# EAGLE design ninja (EAGLE 5.05)
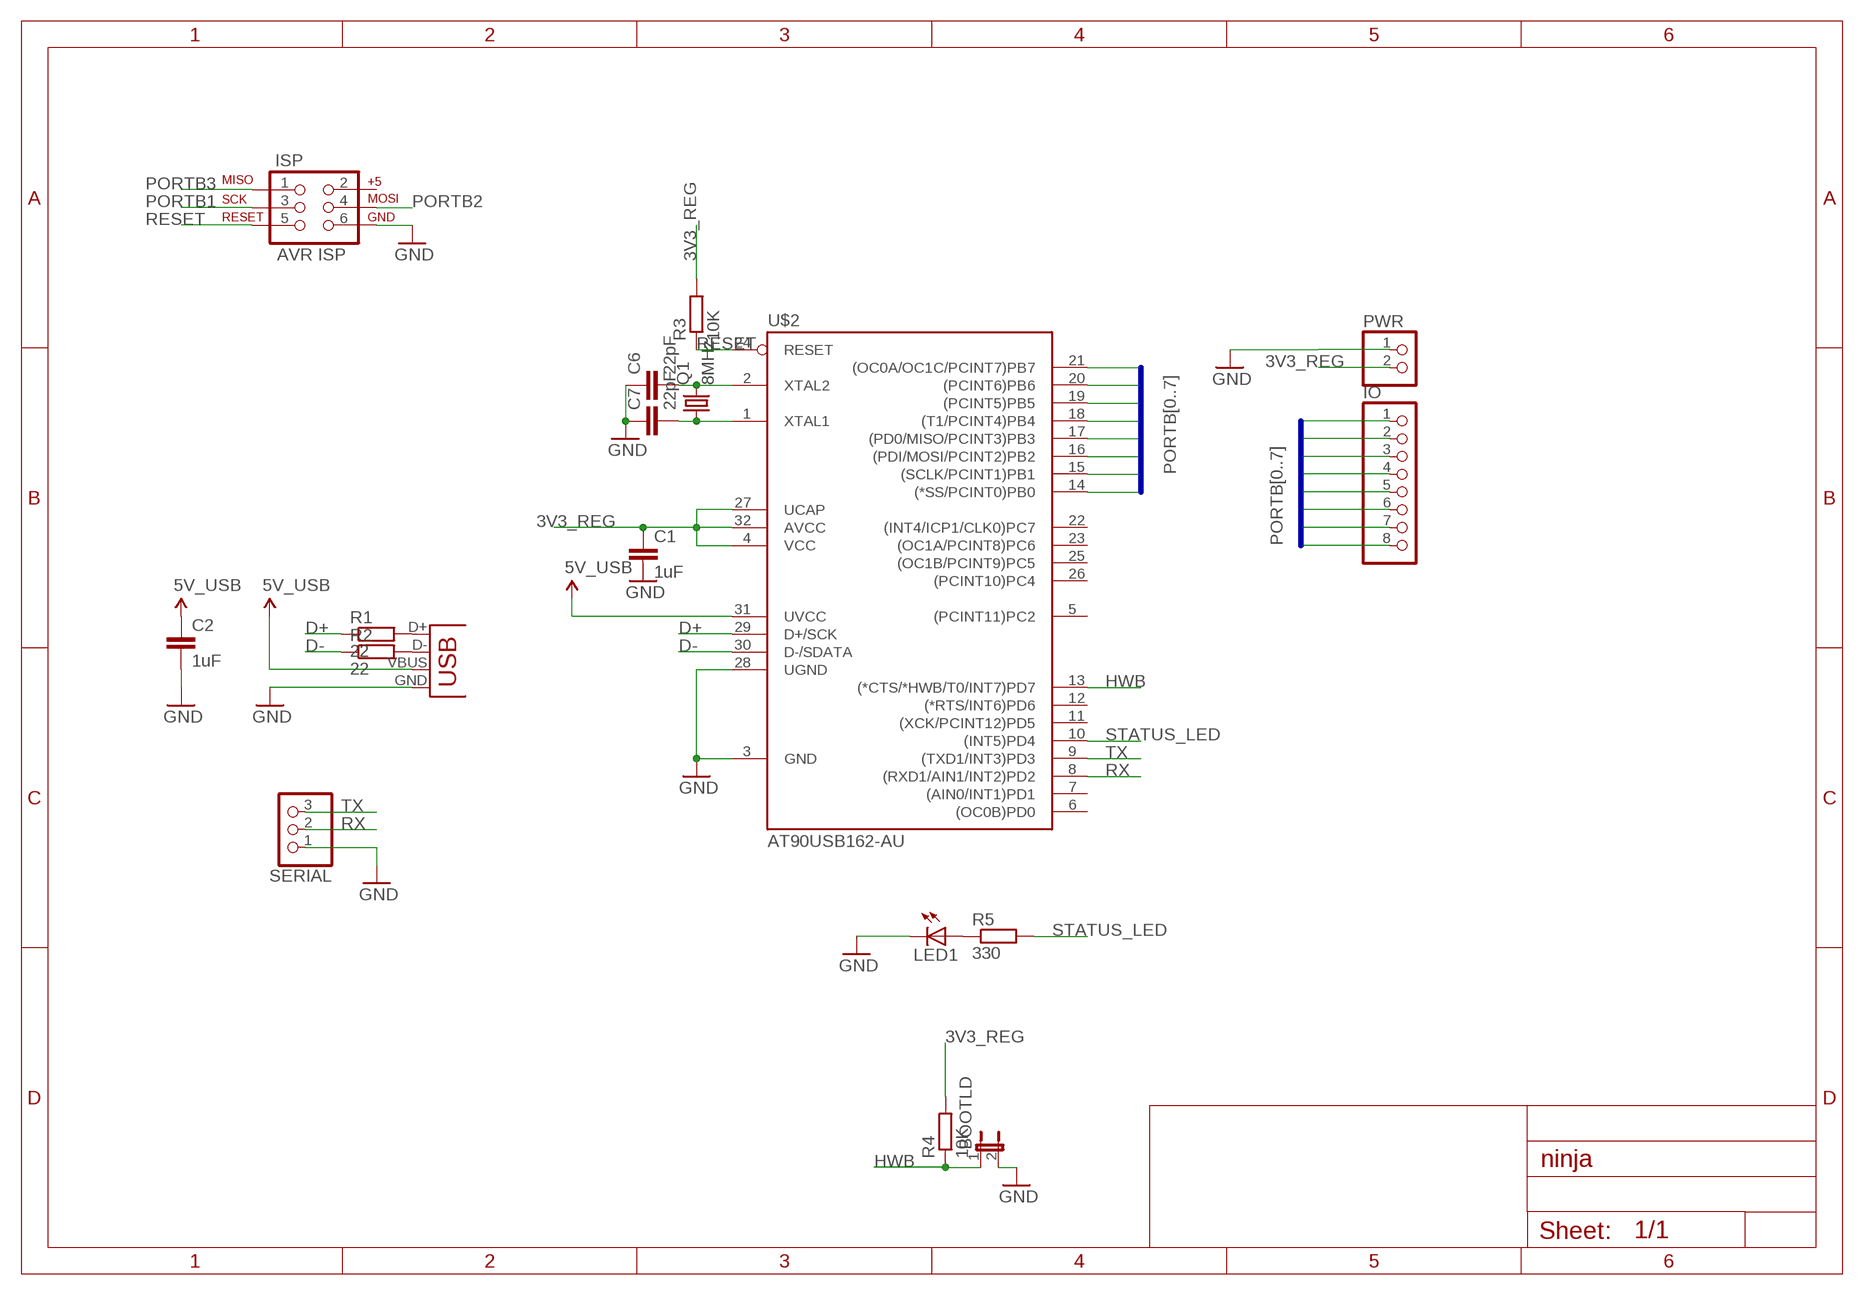
[diagram p0: schematic, sheet 1]

## Parts
BOOTLD  JUMPER-2PTH  [1X02]
C1  1uF  C-EUC1206  [C1206]
C2  1uF  C-EUC1206  [C1206]
C6  22pF  C-EUC1206  [C1206]
C7  22pF  C-EUC1206  [C1206]
IO  PINHD-1X8  [1X08]
ISP  AVR ISP  AVR_SPI_PRG_6NS  [2X3-NS]
LED1  LED1206  [LED-1206]
PWR  PINHD-1X2  [1X02]
Q1  8MHz  CRYSTALHC49U-V  [HC49U-V]
R1  22  R-EU_M1206  [M1206]
R2  22  R-EU_M1206  [M1206]
R3  10K  R-EU_M1206  [M1206]
R4  10K  R-EU_M1206  [M1206]
R5  330  R-EU_M1206  [M1206]
SERIAL  PINHD-1X3  [1X03]
U$2  AT90USB162-AU  [TQFP32-08]
X1  USBSMD  [USB-MINIB]

## Nets
3V3_REG: C1.1 PWR.2 R3.2 R4.2 U$2.4(VCC) U$2.27(UCAP) U$2.32(AVCC)
5V: C2.1 U$2.31(UVCC) X1.VBUS ; supply symbol labelled 5V_USB
D+: R1.1 U$2.29(D+/SCK)
D-: R2.1 U$2.30(D-/SDATA)
GND: BOOTLD.2 C1.2 C2.2 C6.1 C7.1 ISP.6 LED1.C PWR.1 SERIAL.1 U$2.3(GND) U$2.28(UGND) X1.GND
HWB: BOOTLD.1 R4.1 U$2.13((*CTS/*HWB/T0/INT7)PD7)
N$1: R1.2 X1.D+
N$2: R2.2 X1.D-
N$3: C6.2 Q1.2 U$2.2(XTAL2)
N$4: C7.2 Q1.1 U$2.1(XTAL1)
N$6: LED1.A R5.1
PORTB0: IO.8 U$2.14((*SS/PCINT0)PB0)
PORTB1: IO.7 ISP.3 U$2.15((SCLK/PCINT1)PB1)
PORTB2: IO.6 ISP.4 U$2.16((PDI/MOSI/PCINT2)PB2)
PORTB3: IO.5 ISP.1 U$2.17((PD0/MISO/PCINT3)PB3)
PORTB4: IO.4 U$2.18((T1/PCINT4)PB4)
PORTB5: IO.3 U$2.19((PCINT5)PB5)
PORTB6: IO.2 U$2.20((PCINT6)PB6)
PORTB7: IO.1 U$2.21((OC0A/OC1C/PCINT7)PB7)
RESET: ISP.5 R3.1 U$2.24(RESET)
RX: SERIAL.2 U$2.8((RXD1/AIN1/INT2)PD2)
STATUS_LED: R5.2 U$2.10((INT5)PD4)
TX: SERIAL.3 U$2.9((TXD1/INT3)PD3)
Unconnected: ISP.2 U$2.5((PCINT11)PC2) U$2.6((OC0B)PD0) U$2.7((AIN0/INT1)PD1) U$2.11((XCK/PCINT12)PD5) U$2.12((*RTS/INT6)PD6) U$2.22((INT4/ICP1/CLK0)PC7) U$2.23((OC1A/PCINT8)PC6) U$2.25((OC1B/PCINT9)PC5) U$2.26((PCINT10)PC4)

## Buses
PORTB[0..7]

## Library data of the parts
BOOTLD = SparkFun:JUMPER-2: Jumper Basic 0.1" spaced jumper. Use with breakaway headers.
C1 C2 C6 C7 = rcl:C-EU: CAPACITOR, European symbol
IO = pinhead:PINHD-1X8: PIN HEADER
ISP = SparkFun:AVR_SPI_PRG_6: AVR ISP 6 Pin This is the reduced ISP connector for AVR programming. Common on Arduino. This footprint will take up less PCB space and can be used with a 10-pin to 6-pin adapter such as SKU: BOB-08508
LED1 = SparkFun:LED: LEDs Standard schematic elements and footprints for 5mm, 3mm, 1206, and 0603 sized LEDs. 5mm - Spark Fun Electronics SKU : COM-00529 (and others)
PWR = pinhead:PINHD-1X2: PIN HEADER
Q1 = crystal:CRYSTAL: CRYSTAL
R1-R5 = rcl:R-EU_: RESISTOR, European symbol
SERIAL = pinhead:PINHD-1X3: PIN HEADER
U$2 = at90usb:AT90USB162-*
X1 = SparkFun:USB: USB Connectors USB-B-PTH is fully proven SKU : PRT-00139 USB-miniB is fully proven SKU : PRT-00587 USB-A-PCB is untested. USB-A-H is throughly reviewed, but untested. Spark Fun Electronics SKU : PRT-00437 USB-B-SMT is throughly reviewed, but untested. Needs silkscreen touching up. USB-A-S has not been used/tested USB-MB-H has not been used/tested

## Board
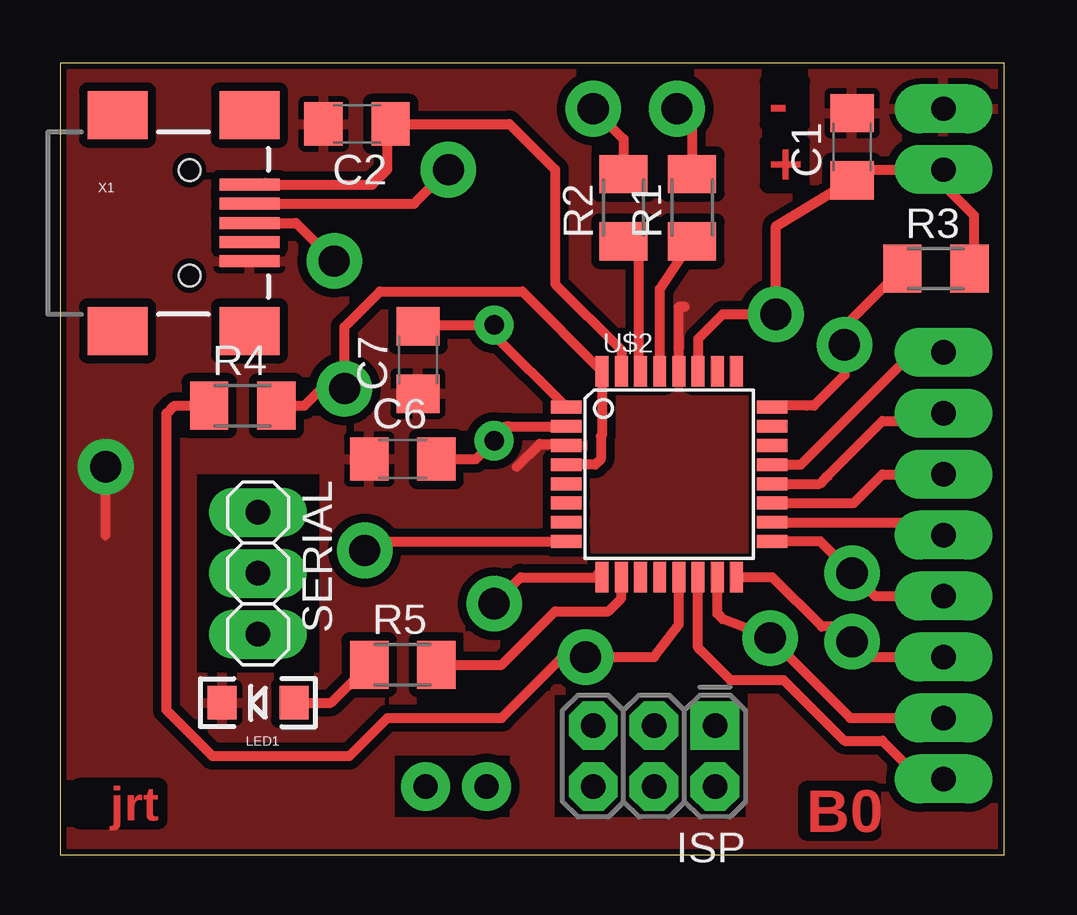
[diagram p1: board, top side]
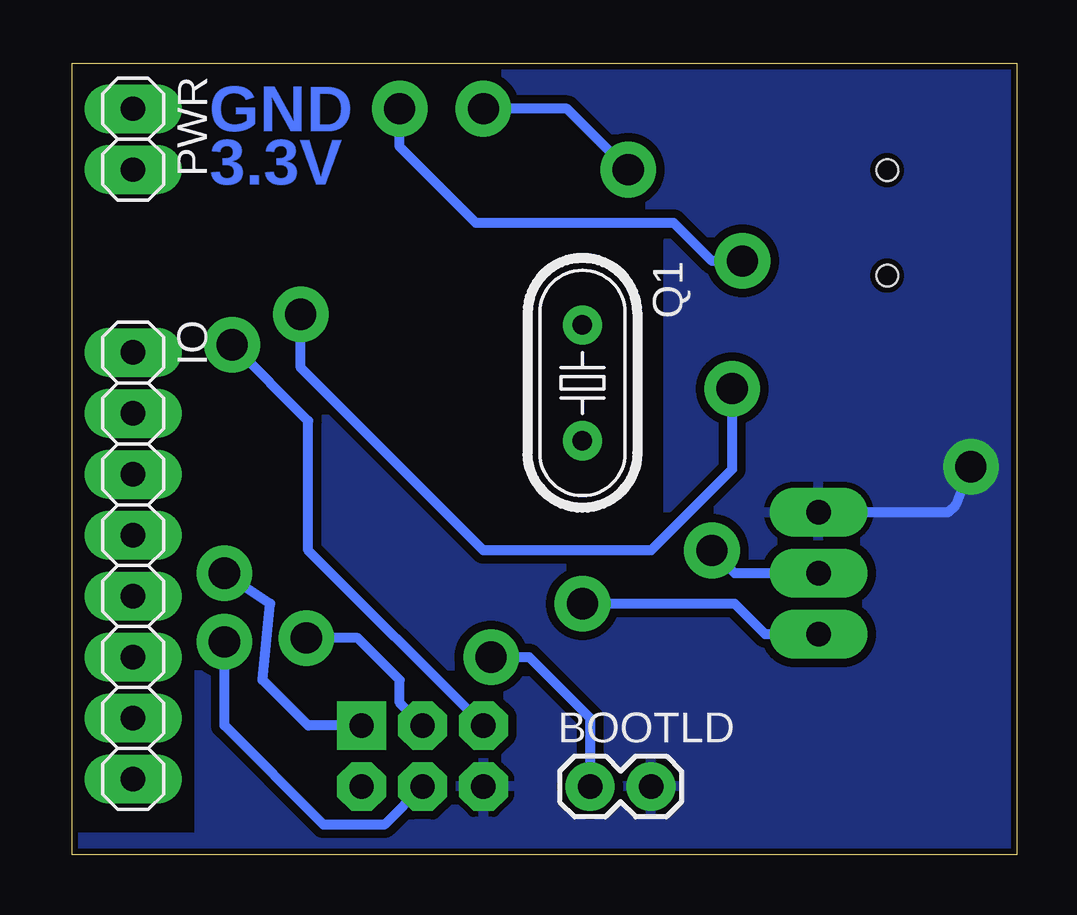
[diagram p2: board, bottom side, seen from below]

Size 39.36 x 33.01 mm. Coordinates in mm from the lower left corner, seen from the top.
Outline: 0,33.01 0,0 39.36,0 39.36,33.01 0,33.01
Copper layers (1*16): Top 0.035mm / dielectric 1.5mm / Bottom 0.035mm
Design rules "toby2 *": minimum track width 8mil, minimum drill 10mil, track to track 14mil, track to pad 14mil, pad to pad 10mil, via to via 10mil, smd to smd 10mil, copper to edge 10mil, drill to drill 8mil, minimum pad ring 16mil, minimum via ring 18mil, stop-mask expansion 4mil, vias tented up to drill 25mil, thermal gap 10mil
tRestrict: area 5.7,7.9 to 10.5,15.5; area 5.7,7.6 to 10.8,15.9; area 20.6,1.6 to 28.6,6.7; area 14,1.6 to 18.7,4.1
bRestrict: area 34,26.7 to 39.4,32.7; area 34.3,0.9 to 39.1,22.8; area 14.9,14 to 21.3,25.7

### Footprints (pad centres in the part's own frame; a part is rotated, then mirrored left to right if it is on the bottom)
1X02 = drill 1.016 pad 1.88 round: 1 0,0; 2 2.54,0
C1206 = smd 1.6 x 1.8: 1 -1.4,0; 2 1.4,0
1X08 = drill 1.016 long: 1 -8.89,0; 2 -6.35,0; 3 -3.81,0; 4 -1.27,0; 5 1.27,0; 6 3.81,0; 7 6.35,0; 8 8.89,0
2X3-NS = drill 1.016 pad 1.88 square: 1 -2.54,-1.27 | drill 1.016 pad 1.88 octagon: 2 -2.54,1.27; 3 0,-1.27; 4 0,1.27; 5 2.54,-1.27; 6 2.54,1.27
LED-1206 = smd 1.2 x 1.4: A -1.5,0; C 1.5,0
1X02' = drill 1.016 long: 1 -1.27,0; 2 1.27,0
HC49U-V = drill 0.813 round: 1 -2.413,0; 2 2.413,0
M1206 = smd 1.6 x 2: 1 -1.4,0; 2 1.4,0
1X03 = drill 1.016 long: 1 -2.54,0; 2 0,0; 3 2.54,0
TQFP32-08 = smd 1.27 x 0.533: 1 -4.293,2.8; 2 -4.293,2; 3 -4.293,1.2; 4 -4.293,0.4; 5 -4.293,-0.4; 6 -4.293,-1.2; 7 -4.293,-2; 8 -4.293,-2.8; 17 4.293,-2.8; 18 4.293,-2; 19 4.293,-1.2; 20 4.293,-0.4; 21 4.293,0.4; 22 4.293,1.2; 23 4.293,2; 24 4.293,2.8 | smd 0.533 x 1.27: 9 -2.8,-4.293; 10 -2,-4.293; 11 -1.2,-4.293; 12 -0.4,-4.293; 13 0.4,-4.293; 14 1.2,-4.293; 15 2,-4.293; 16 2.8,-4.293; 25 2.8,4.293; 26 2,4.293; 27 1.2,4.293; 28 0.4,4.293; 29 -0.4,4.293; 30 -1.2,4.293; 31 -2,4.293; 32 -2.8,4.293
USB-MINIB = smd 2.5 x 0.5: D+ 2.5,0; D- 2.5,0.8; GND 2.5,-1.6; ID 2.5,-0.8; VBUS 2.5,1.6 | smd 2.5 x 2: GND@1 -3,-4.5; GND@2 -3,4.5; GND@3 2.5,4.5; GND@4 2.5,-4.5 | hole 0.9: 0,2.2; 0,-2.2

### Placement (x,y rotation side)
BOOTLD  17.78,2.85 0 bottom
C1  33.02,29.52 90 top
C2  12.38,30.47 180 top
C6  14.29,16.5 0 top
C7  14.92,20.62 90 top
IO  36.83,12.05 270 bottom
ISP  24.77,4.12 180 top
LED1  8.26,6.34 180 top
PWR  [1X02']  36.83,29.83 270 bottom
Q1  18.1,19.67 270 bottom
R1  26.35,26.98 90 top
R2  23.49,26.98 90 top
R3  36.51,24.44 0 top
R4  7.62,18.72 0 top
R5  14.29,7.93 0 top
SERIAL  8.26,11.73 270 top
U$2  25.4,15.86 0 top
X1  5.4,26.34 0 top

### Tracks (layer width: path | path; a pad name or v marks a point on that pad's centre or on a via)
3V3_REG  (via drill 1.3)
  Top 0.406: U$2.27 26.67,20.16 | U$2.32 22.54,20.21 | U$2.32 22.54,20.1 22.54,20.31 | U$2.27 26.67,20.23 | v11.86,19.43 11.75,19.55 | U$2.32 22.6,17.51 22.54,17.45 22.54,16.5 22.31,16.26 U$2.4 | U$2.32 19.27,23.48 13.34,23.48 11.86,22.01 v11.86,19.43 | v11.86,19.43 10.91,19.43 10.2,18.72 R4.2 | R3.2 38.1,24.62 38.1,26.66 36.83,27.93 PWR.2 33.47,28.56 C1.1 29.84,26.21 v29.84,22.53 27.62,22.53 26.6,21.51 U$2.27
  Bottom 0.406: v11.86,19.43 11.86,16.07 15.24,12.69 22.23,12.69 29.84,20.31 v29.84,22.53
5V
  Top 0.406: U$2.31 23.4,21.04 20.64,23.8 20.64,28.56 18.73,30.47 C2.1 13.65,30.34 13.65,28.56 13.02,27.93 12.06,27.93 8.65,27.93 8.56,28.02 7.91,27.93 X1.VBUS
D+
  Top 0.406: U$2.29 25,23.59 R1.1
D-
  Top 0.406: U$2.30 24.13,20.23 24.13,22.85 24.13,24.94 R2.1
GND  (via drill 1.3)
  Top 0.406: U$2.3 21.04,17.13 20,17.13 19.05,16.18 | U$2.28 25.8,22.85 26.04,22.85 | 1.91,13.32 v1.91,16.18
  Bottom 0.406: SERIAL.1 2.86,14.27 2.54,14.59 v1.91,16.18
  pour Top: 39.37,33.01 39.37,-0.01 0,-0.01 0,33.01
  pour Bottom: 39.37,33.01 39.37,-0.01 0,-0.01 0,33.01
HWB  (via drill 1.3)
  Top 0.406: U$2.13 25.8,10.47 25.8,9.59 24.77,8.24 v21.91,8.24 20.95,8.24 18.41,5.7 16.19,5.7 13.65,5.7 12.06,4.12 6.35,4.12 6.03,4.43 4.63,5.83 4.45,6.02 4.45,18.4 4.76,18.72 R4.1
  Bottom 0.406: v21.91,8.24 20.32,8.24 19.37,7.29 17.78,5.7 BOOTLD.1
N$1  (via drill 1.3)
  Top 0.406: X1.D+ 9.84,26.34 v11.43,24.75 | R1.2 26.35,30.47 v25.72,31.1
  Bottom 0.406: v11.43,24.75 12.7,24.75 14.29,26.34 22.54,26.34 25.72,29.51 v25.72,31.1
N$2  (via drill 1.3)
  Top 0.406: X1.D- 14.6,27.14 14.77,27.14 v16.19,28.56 | v22.23,31.1 23.49,29.83 R2.2
  Bottom 0.406: v22.23,31.1 18.73,31.1 16.51,28.88 v16.19,28.56
N$3
  Top 0.406: U$2.2 18.7,17.86 arc90 Q1.2 17.34,16.5 C6.2
N$4
  Top 0.406: U$2.1 18.1,21.67 Q1.1 14.98,22.09 C7.2
N$6
  Top 0.406: LED1.A 11.3,6.34 R5.1
N$8
  pour Bottom: 40.64,22.85 40.64,22.85
PORTB0
  Top 0.406: 26.67,11.5 U$2.14 26.6,8.63 26.67,8.56 27.94,7.29 28.89,7.29 30.16,7.29 32.7,4.75 34.29,4.75 36.2,2.85 36.51,2.85 IO.8
PORTB1  (via drill 1.3)
  Top 0.406: 29.36,9.16 27.62,9.83 27.4,10.05 U$2.15 | v29.6,9.04 29.36,9.16 | v29.6,9.04 29.36,9.16 | v29.6,9.04 32.94,5.7 IO.7
  Bottom 0.406: ISP.3 25.72,6.34 25.72,7.29 27.47,9.04 v29.6,9.04
PORTB2  (via drill 1.3)
  Top 0.406: U$2.16 29.69,11.57 31.75,9.51 32.39,9.51 v33.02,8.88 33.66,8.24 IO.6
  Bottom 0.406: ISP.4 26.35,1.26 28.26,1.26 28.58,1.26 28.89,1.26 33.02,5.38 v33.02,8.88
PORTB3  (via drill 1.3)
  Top 0.406: IO.5 35.24,10.78 33.97,10.78 v33.02,11.73 31.69,13.06 U$2.17
  Bottom 0.406: v33.02,11.73 31.12,10.47 31.43,7.29 29.53,5.38 ISP.1
PORTB4
  Top 0.406: U$2.18 35.88,13.86 35.88,13.96 36.83,13.96 IO.4
PORTB5
  Top 0.406: U$2.19 32.63,14.66 33.09,14.66 34.29,15.86 IO.3
PORTB6
  Top 0.406: U$2.20 31.67,15.46 31.91,15.7 | 31.91,15.7 32.07,15.86 | 31.91,15.7 34.29,18.08 36.83,18.08 IO.2
PORTB7
  Top 0.406: U$2.21 30.88,16.26 33.34,18.72 35.56,20.94 IO.1
RESET  (via drill 1.3)
  Top 0.406: U$2.24 29.75,18.72 31.12,18.72 31.43,18.72 32.7,19.99 v32.7,21.26 32.7,22.02 R3.1
  Bottom 0.406: ISP.5 29.53,12.69 29.53,18.08 v32.7,21.26
RX  (via drill 1.3)
  Top 0.406: U$2.8 13.08,13.06 v12.7,12.69
  Bottom 0.406: v12.7,12.69 11.75,11.73 SERIAL.2
STATUS_LED
  Top 0.406: U$2.10 23.4,10.69 22.86,10.15 20.64,10.15 18.41,7.93 R5.2
TX  (via drill 1.3)
  Top 0.406: 22.44,11.73 U$2.9 19.2,11.57 v18.1,10.47
  Bottom 0.406: SERIAL.3 10.48,9.19 11.75,10.47 17.78,10.47 v18.1,10.47

### Text on the board
Top: - | + | jrt | B0
Bottom: GND | 3.3V